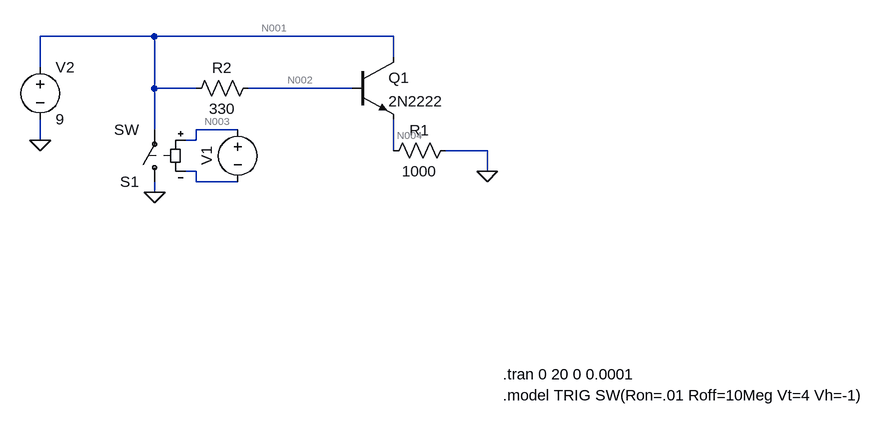
[diagram p0: schematic transistorTesting.asc]
transistorTesting.asc, the LTspice schematic file:
Version 4
SHEET 1 1032 680
WIRE -112 48 -288 48
WIRE 256 48 -112 48
WIRE 256 80 256 48
WIRE -288 96 -288 48
WIRE -112 128 -112 48
WIRE -48 128 -112 128
WIRE 192 128 32 128
WIRE -112 192 -112 128
WIRE 16 192 -48 192
WIRE -288 208 -288 176
WIRE -48 208 -48 192
WIRE -48 208 -64 208
WIRE 256 224 256 176
WIRE 400 224 336 224
WIRE -48 256 -64 256
WIRE 400 256 400 224
WIRE -48 272 -48 256
WIRE 16 272 -48 272
WIRE -112 288 -112 272
FLAG -288 208 0
FLAG 400 256 0
FLAG -112 288 0
SYMBOL npn 192 80 R0
SYMATTR InstName Q1
SYMATTR Value 2N2222
SYMBOL sw -112 288 R180
SYMATTR InstName S1
SYMATTR SpiceModel TRIG
SYMBOL voltage 16 176 R0
WINDOW 0 -32 56 VBottom 2
WINDOW 3 32 56 Invisible 2
WINDOW 123 0 0 Left 0
WINDOW 39 0 0 Left 0
SYMATTR InstName V1
SYMATTR Value PULSE(0 5 0 0.00001 0.00001 4 5 5)
SYMBOL voltage -288 80 R0
WINDOW 123 0 0 Left 0
SYMATTR InstName V2
SYMATTR Value 9
SYMATTR SpiceLine Rser=1
SYMBOL res 352 208 R90
WINDOW 0 0 56 VBottom 2
WINDOW 3 32 56 VTop 2
SYMATTR InstName R1
SYMATTR Value 1000
SYMBOL res 48 112 R90
WINDOW 0 0 56 VBottom 2
WINDOW 3 32 56 VTop 2
SYMATTR InstName R2
SYMATTR Value 330
TEXT 424 600 Left 2 !.model TRIG SW(Ron=.01 Roff=10Meg Vt=4 Vh=-1)
TEXT 424 568 Left 2 !.tran 0 20 0 0.0001

The netlist it stands for:
* transistorTesting.asc
Q1 N001 N002 N004 0 2N2222
S1 0 N001 N003 N005 TRIG SW
V1 N003 N005 PULSE(0 5 0 0.00001 0.00001 4 5 5)
V2 N001 0 9 Rser=1
R1 0 N004 1000
R2 N002 N001 330
.model NPN NPN
.model PNP PNP
.lib standard.bjt
.model TRIG SW(Ron=.01 Roff=10Meg Vt=4 Vh=-1)
.tran 0 20 0 0.0001
.backanno
.end

* Results of the author's LTspice run, read from the files saved beside the schematic
* Operating Point, zero values left out:
*   V(n001) = 8.992 V
*   V(n002) = 8.978 V
*   V(n004) = 8.265 V
*   Ic(Q1) = 8.223 mA
*   Ib(Q1) = 42.24 µA
*   Ie(Q1) = -8.265 mA
*   I(R1) = -8.265 mA
*   I(R2) = -42.24 µA
*   I(S1) = 899.2 nA
*   I(V2) = -8.266 mA
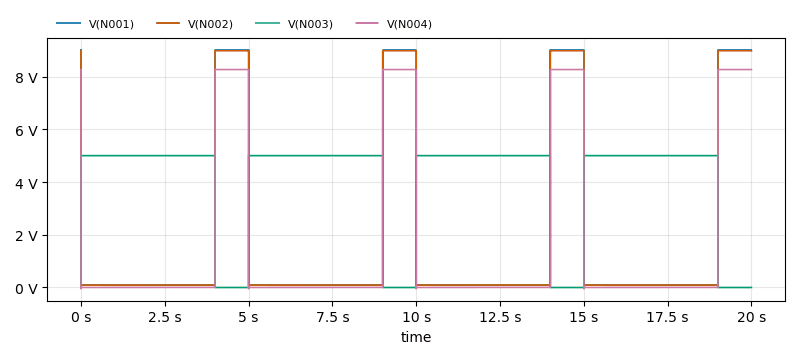
[diagram p1: Transient Analysis of transistorTesting.asc, plotted from the saved traces]
* Transient Analysis, 1 run:
*   V(N001): min 89.11 mV, max 8.993 V, average 1.87 V, rms 4.022 V, last 8.992 V
*   V(N002): min 89.11 mV, max 8.978 V, average 1.867 V, rms 4.016 V, last 8.978 V
*   V(N003): min 0 V, max 5 V, average 4 V, rms 4.472 V, last 0 V
*   V(N004): min -50.96 mV, max 8.266 V, average 1.653 V, rms 3.696 V, last 8.265 V